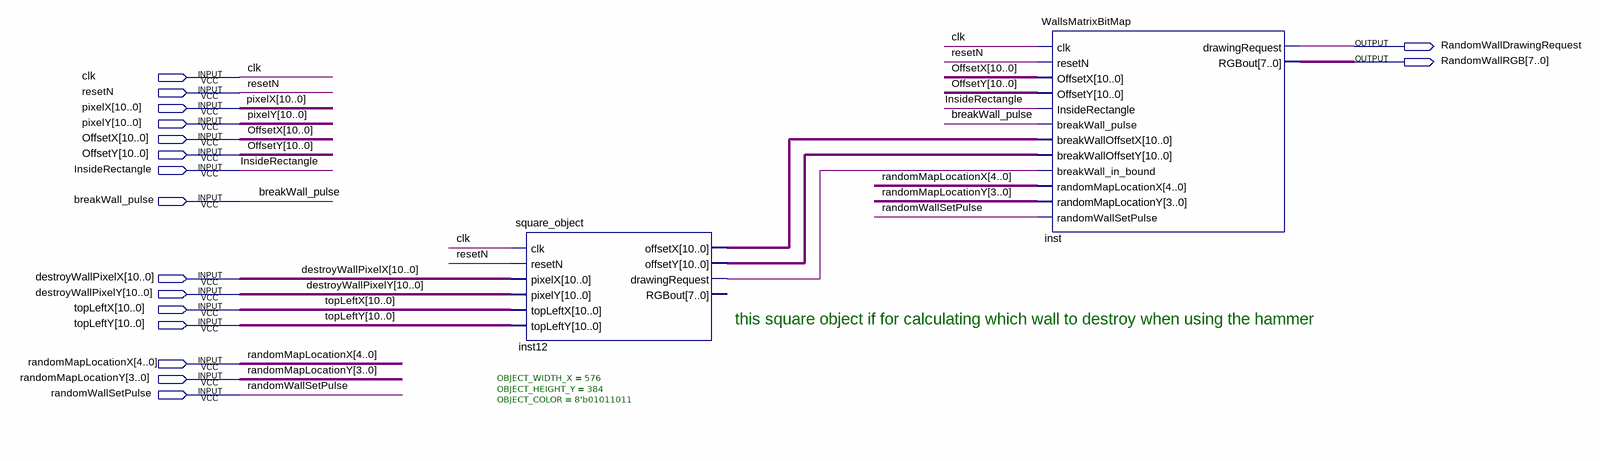
[diagram p0: schematic sheet]
// Quartus schematic Background_Block.bdf as structural Verilog: 2 symbols, 17 pins
module Background_Block (
  input  clk,
  input  resetN,
  input  [10:0] pixelX,
  input  [10:0] pixelY,
  input  [10:0] OffsetX,
  input  [10:0] OffsetY,
  input  InsideRectangle,
  input  breakWall_pulse,
  input  [10:0] destroyWallPixelX,
  input  [10:0] destroyWallPixelY,
  input  [10:0] topLeftX,
  input  [10:0] topLeftY,
  input  [4:0] randomMapLocationX,
  input  [3:0] randomMapLocationY,
  input  randomWallSetPulse,
  output RandomWallDrawingRequest,
  output [7:0] RandomWallRGB
);

  wire inst12_drawingrequest;
  wire [10:0] inst12_offsetx, inst12_offsety;

  square_object #(.OBJECT_WIDTH_X(576), .OBJECT_HEIGHT_Y(384), .OBJECT_COLOR(8'b01011011)) inst12 (
    .clk(clk), .resetN(resetN), .pixelX(destroyWallPixelX), .pixelY(destroyWallPixelY), .topLeftX(topLeftX),
    .topLeftY(topLeftY), .offsetX(inst12_offsetx), .offsetY(inst12_offsety),
    .drawingRequest(inst12_drawingrequest));  // open: RGBout
  WallsMatrixBitMap inst (
    .clk(clk), .resetN(resetN), .OffsetX(OffsetX), .OffsetY(OffsetY), .InsideRectangle(InsideRectangle),
    .breakWall_pulse(breakWall_pulse), .breakWallOffsetX(inst12_offsetx), .breakWallOffsetY(inst12_offsety),
    .breakWall_in_bound(inst12_drawingrequest), .randomMapLocationX(randomMapLocationX),
    .randomMapLocationY(randomMapLocationY), .randomWallSetPulse(randomWallSetPulse),
    .drawingRequest(RandomWallDrawingRequest), .RGBout(RandomWallRGB));

  // Notes on the sheet:
  //   this square object if for calculating which wall to destroy when using the hammer
endmodule
